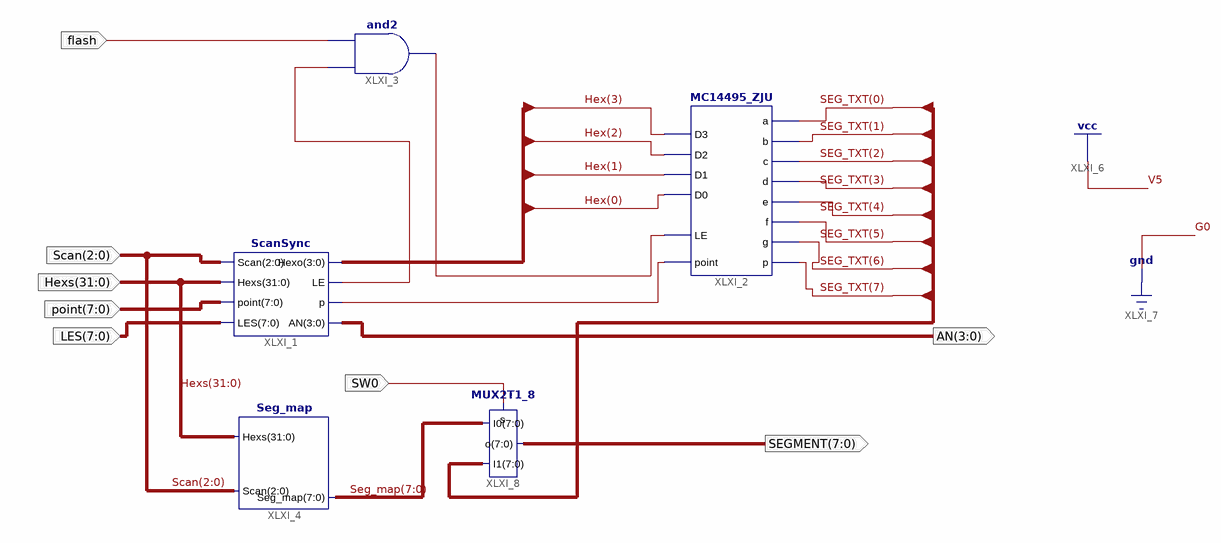
[diagram p0: schematic sheet 1]
// Xilinx ISE schematic Seg7_Dev.sch (kintex7) as structural Verilog: 5 symbols, 8 ports
module Seg7_Dev (
  input  [2:0] Scan,
  input  [7:0] point,
  input  [7:0] LES,
  input  flash,
  input  [31:0] Hexs,
  input  SW0,
  output [3:0] AN,
  output [7:0] SEGMENT
);

  wire XLXN_12, XLXN_19, XLXN_29;
  wire [3:0] Hex;
  wire [7:0] Seg_map, SEG_TXT;

  ScanSync XLXI_1 (.LES(LES), .AN(AN), .point(point), .p(XLXN_12), .Hexo(Hex), .Hexs(Hexs), .Scan(Scan), .LE(XLXN_19));
  MC14495_ZJU XLXI_2 (
    .D0(Hex[0]), .D1(Hex[1]), .D2(Hex[2]), .D3(Hex[3]), .p(SEG_TXT[7]), .g(SEG_TXT[6]), .f(SEG_TXT[5]),
    .e(SEG_TXT[4]), .d(SEG_TXT[3]), .c(SEG_TXT[2]), .b(SEG_TXT[1]), .a(SEG_TXT[0]), .point(XLXN_12),
    .LE(XLXN_29));
  and XLXI_3 (XLXN_29, XLXN_19, flash);
  Seg_map XLXI_4 (.Hexs(Hexs), .Seg_map(Seg_map), .Scan(Scan));
  MUX2T1_8 XLXI_8 (.o(SEGMENT), .I0(Seg_map), .s(SW0), .I1(SEG_TXT));
endmodule
